# EAGLE design ports (EAGLE 6.6.0)
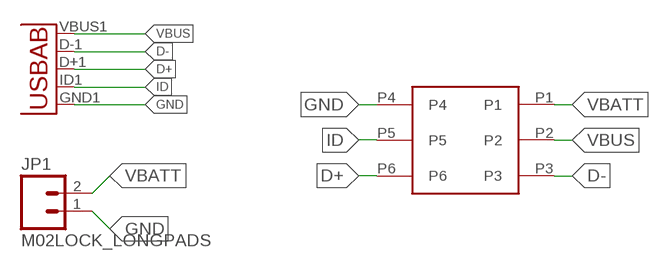
[diagram p0: schematic, sheet 1]

## Parts
JP1  M02LOCK_LONGPADS  [1X02_LOCK_LONGPADS]
U$1  G125-FV20605L0P  [G125-FV20605L0P]
U$4  USB-AB""  [USB-AB-MICRO-SMD_V02_BOSS]

## Nets
D+: U$1.P6 U$4.D+1(D+)
D-: U$1.P3 U$4.D-1(D-)
GND: JP1.1 U$1.P4 U$4.GND1(GND)
ID: U$1.P5 U$4.ID1(USBID)
VBATT: JP1.2 U$1.P1
VBUS: U$1.P2 U$4.VBUS1(VBUS)

## Library data of the parts
JP1 = SparkFun-Connectors:M02: Standard 2-pin 0.1" header. Use with - straight break away headers ( PRT-00116) - right angle break away headers (PRT-00553) - swiss pins (PRT-00743) - machine pins (PRT-00117) - female headers (PRT-00115) Molex polarized connector foot print use with: PRT-08233 with associated crimp pins and housings. 2.54_SCREWTERM for use with PRT-10571. 3.5mm Screw Terminal footprints for PRT-08084 5mm Screw Terminal footprints for use with PRT-08433
U$1 = G125-FV20605L0P:G125-FV20605L0P: Harwin Gecko female connector, 2x3
U$4 = Testing:USB-AB: This is a USB AB connector that is compatible with USB OTG. i.e. this connector can serve as a host or device

## Board
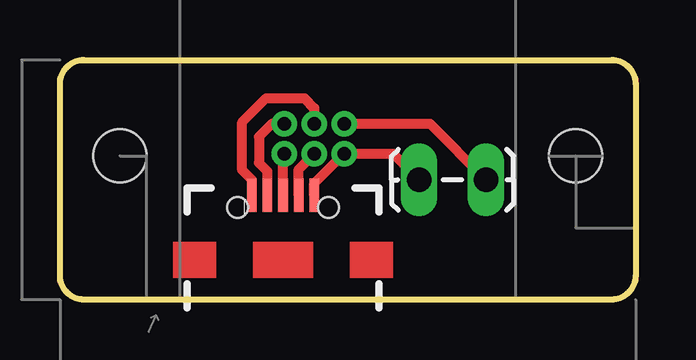
[diagram p1: board, top side]
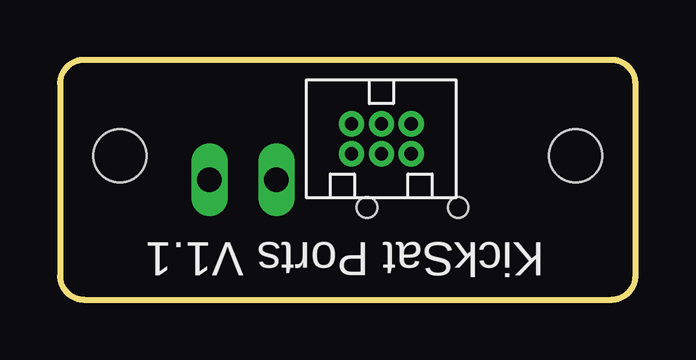
[diagram p2: board, bottom side, seen from below]

Size 24 x 10 mm. Coordinates in mm from the lower left corner, seen from the top.
Outline: 23,0 1,0 arc-90 0,1 0,9 arc-90 1,10 23,10 arc-90 24,9 24,1 arc-90 23,0
Copper layers (1*16): Top 0.0356mm / dielectric 1.5011mm / Bottom 0.0356mm
Design rules "OSHPark-2layer": minimum track width 6mil, minimum drill 13mil, track to track 6mil, track to pad 6mil, pad to pad 6mil, via to via 6mil, smd to smd 6mil, copper to edge 15mil, drill to drill 6mil, minimum pad ring 7mil, minimum via ring 7mil, stop-mask expansion 4mil, vias tented up to drill 0mil, thermal gap 10mil
Holes 2.2 mm at 2.5,6 21.5,6

### Footprints (pad centres in the part's own frame; a part is rotated, then mirrored left to right if it is on the bottom)
1X02_LOCK_LONGPADS = drill 1.016 long: 1 -0.127,0; 2 2.667,0
G125-FV20605L0P = drill 0.55 pad 1.05: P1 -1.25,3.085; P2 0,3.085; P3 1.25,3.085; P4 -1.25,1.835; P5 0,1.835; P6 1.25,1.835
USB-AB-MICRO-SMD_V02_BOSS = smd 1.4 x 0.4: D+1 2.7,0; D-1 2.7,0.65; GND1 2.7,-1.3; ID1 2.7,-0.65; VBUS1 2.7,1.3 | hole 0.85: 2.2,1.9; 2.2,-1.9

### Placement (x,y rotation side)
JP1  15.1,5 0 top
U$1  10.6,4.25 0 bottom
U$4  9.3,1.65 90 top

### Tracks (layer width: path | path; a pad name or v marks a point on that pad's centre or on a via)
D+
  Top 0.406: U$4.D+1 9.3,6.04 U$1.P6
D-
  Top 0.406: U$4.D-1 8.65,5.35 8.3,5.7 8.3,6.8 8.84,7.33 U$1.P3
GND
  Top 0.406: U$4.GND1 10.6,4.83 U$1.P4 13.89,6.08 JP1.1
ID
  Top 0.406: U$4.ID1 9.95,5.43 U$1.P5
VBATT
  Top 0.406: U$1.P1 15.43,7.33 JP1.2
VBUS
  Top 0.406: U$4.VBUS1 8,5 7.6,5.4 7.6,7.4 8.6,8.4 10.2,8.4 10.6,8 U$1.P2

### Text on the board
bNames: KickSat Ports V1.1
tDocu: Thickness = 1.6